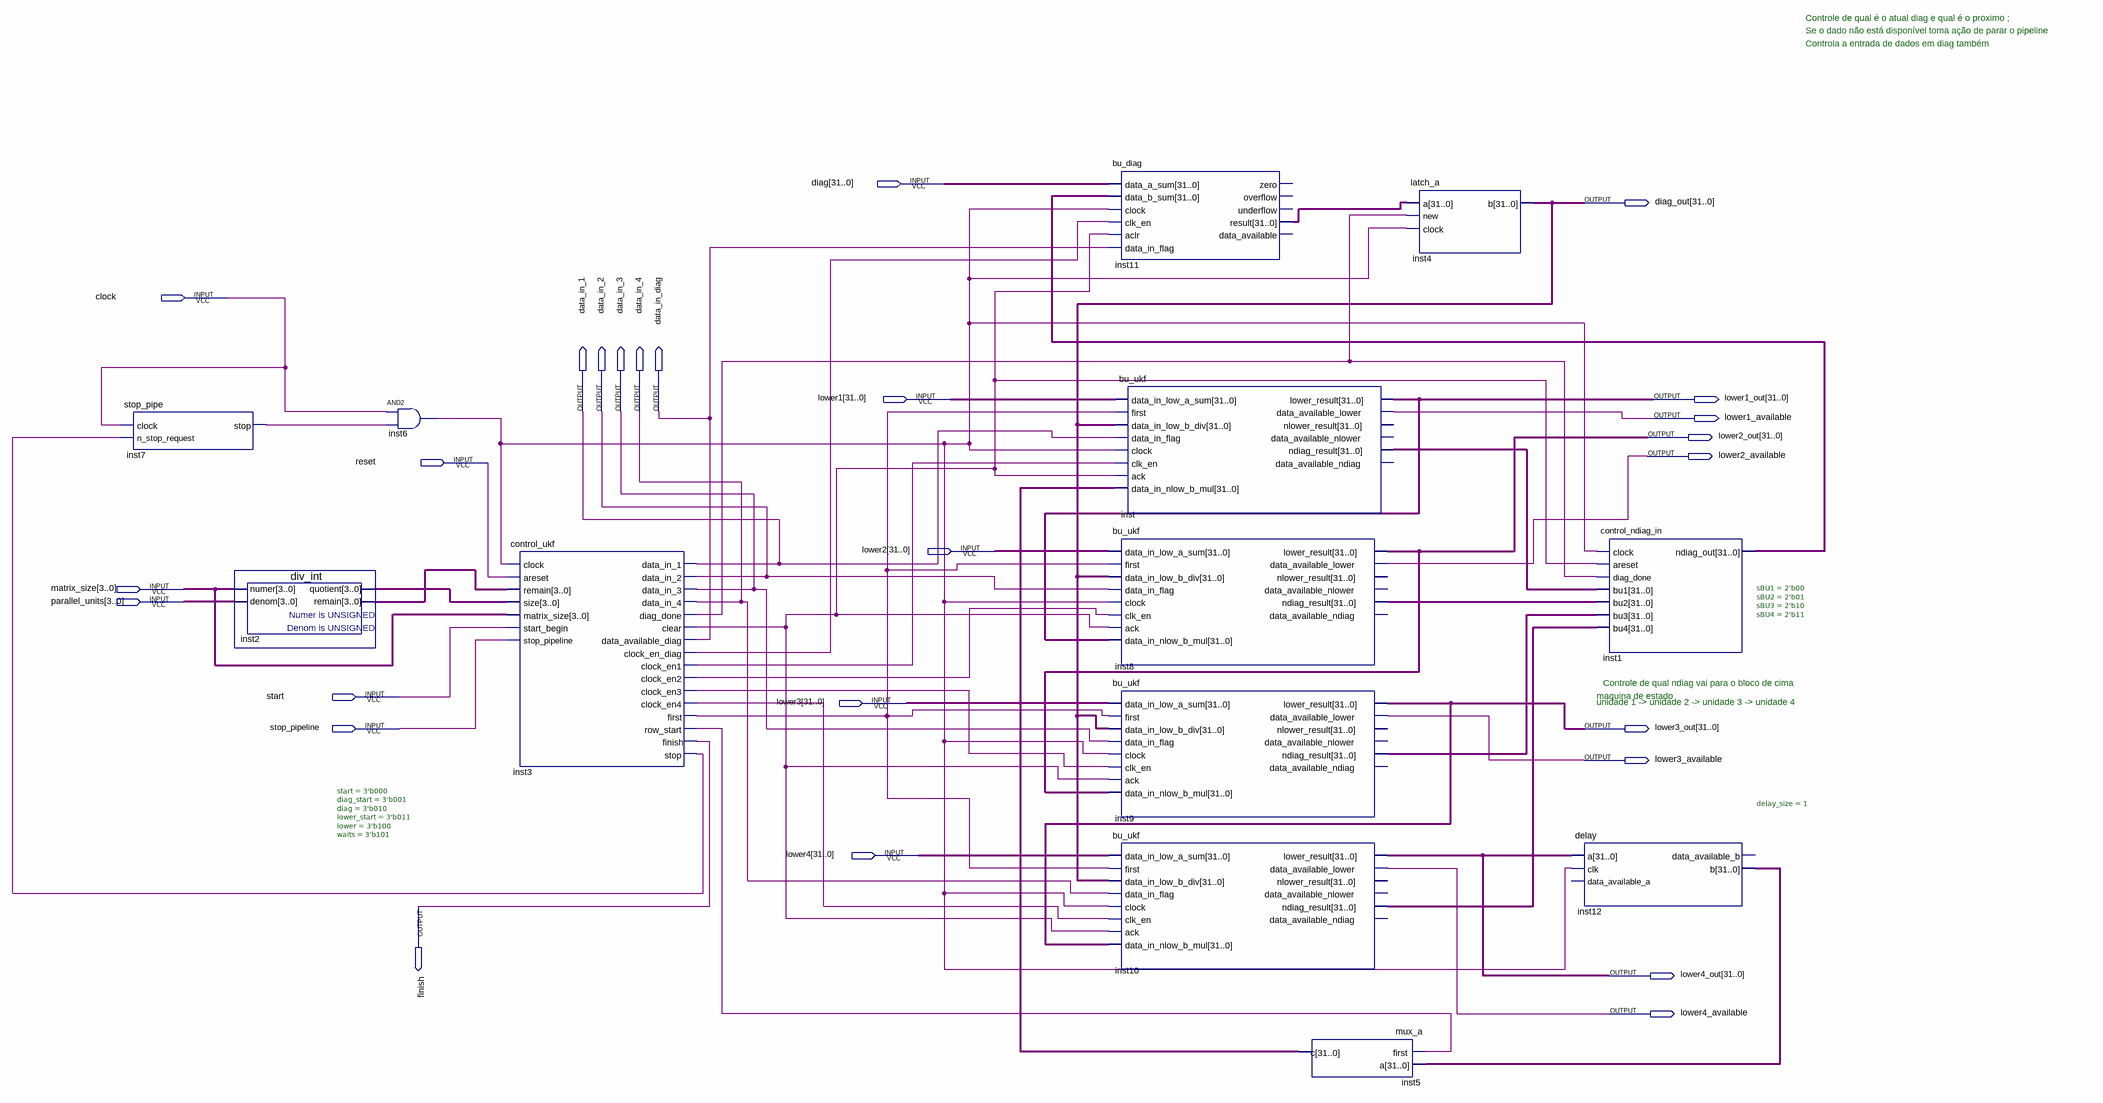
[diagram p0: schematic sheet]
// Quartus schematic ukf.bdf as structural Verilog: 13 symbols, 26 pins
module ukf (
  input  [31:0] diag,
  input  clock,
  input  [31:0] lower1,
  input  reset,
  input  [31:0] lower2,
  input  [3:0] matrix_size,
  input  [3:0] parallel_units,
  input  start,
  input  [31:0] lower3,
  input  stop_pipeline,
  input  [31:0] lower4,
  output [31:0] diag_out,
  output [31:0] lower1_out,
  output data_in_1,
  output data_in_2,
  output data_in_3,
  output data_in_4,
  output data_in_diag,
  output lower1_available,
  output [31:0] lower2_out,
  output lower2_available,
  output [31:0] lower3_out,
  output lower3_available,
  output finish,
  output [31:0] lower4_out,
  output lower4_available
);

  wire inst3_clear, inst3_clock_en1, inst3_clock_en2, inst3_clock_en3, inst3_clock_en4, inst3_clock_en_diag,
       inst3_diag_done, inst3_first, inst3_row_start, inst3_stop, inst6_out, inst7_stop;
  wire [3:0] inst2_quotient, inst2_remain;
  wire [31:0] inst1_ndiag_out, inst5_c, inst8_ndiag_result, inst9_ndiag_result, inst10_ndiag_result,
       inst11_result, inst12_b, inst_ndiag_result;

  stop_pipe inst7 (.clock(clock), .n_stop_request(inst3_stop), .stop(inst7_stop));
  div_int inst2 (.numer(matrix_size), .denom(parallel_units), .quotient(inst2_quotient), .remain(inst2_remain));
  and inst6 (inst6_out, clock, inst7_stop);
  control_ukf #(.start(3'b000), .diag_start(3'b001), .diag(3'b010), .lower_start(3'b011), .lower(3'b100), .waits(3'b101)) inst3 (
    .clock(inst6_out), .areset(reset), .remain(inst2_remain), .size(inst2_quotient),
    .matrix_size(matrix_size), .start_begin(start), .stop_pipeline(stop_pipeline), .data_in_1(data_in_1),
    .data_in_2(data_in_2), .data_in_3(data_in_3), .data_in_4(data_in_4), .diag_done(inst3_diag_done),
    .clear(inst3_clear), .data_available_diag(data_in_diag), .clock_en_diag(inst3_clock_en_diag),
    .clock_en1(inst3_clock_en1), .clock_en2(inst3_clock_en2), .clock_en3(inst3_clock_en3),
    .clock_en4(inst3_clock_en4), .first(inst3_first), .row_start(inst3_row_start), .finish(finish),
    .stop(inst3_stop));
  bu_diag inst11 (
    .data_a_sum(diag), .data_b_sum(inst1_ndiag_out), .clock(inst6_out), .clk_en(inst3_clock_en_diag),
    .aclr(inst3_clear), .data_in_flag(data_in_diag), .result(inst11_result));  // open: zero, overflow, underflow, data_available
  bu_ukf inst (
    .data_in_low_a_sum(lower1), .first(inst3_first), .data_in_low_b_div(diag_out), .data_in_flag(data_in_1),
    .clock(inst6_out), .clk_en(inst3_clock_en1), .ack(inst3_clear), .data_in_nlow_b_mul(inst5_c),
    .lower_result(lower1_out), .data_available_lower(lower1_available), .ndiag_result(inst_ndiag_result));  // open: nlower_result, data_available_nlower, data_available_ndiag
  bu_ukf inst8 (
    .data_in_low_a_sum(lower2), .first(inst3_first), .data_in_low_b_div(diag_out), .data_in_flag(data_in_2),
    .clock(inst6_out), .clk_en(inst3_clock_en2), .ack(inst3_clear), .data_in_nlow_b_mul(lower1_out),
    .lower_result(lower2_out), .data_available_lower(lower2_available), .ndiag_result(inst8_ndiag_result));  // open: nlower_result, data_available_nlower, data_available_ndiag
  bu_ukf inst9 (
    .data_in_low_a_sum(lower3), .first(inst3_first), .data_in_low_b_div(diag_out), .data_in_flag(data_in_3),
    .clock(inst6_out), .clk_en(inst3_clock_en3), .ack(inst3_clear), .data_in_nlow_b_mul(lower2_out),
    .lower_result(lower3_out), .data_available_lower(lower3_available), .ndiag_result(inst9_ndiag_result));  // open: nlower_result, data_available_nlower, data_available_ndiag
  bu_ukf inst10 (
    .data_in_low_a_sum(lower4), .first(inst3_first), .data_in_low_b_div(diag_out), .data_in_flag(data_in_4),
    .clock(inst6_out), .clk_en(inst3_clock_en4), .ack(inst3_clear), .data_in_nlow_b_mul(lower3_out),
    .lower_result(lower4_out), .data_available_lower(lower4_available), .ndiag_result(inst10_ndiag_result));  // open: nlower_result, data_available_nlower, data_available_ndiag
  mux_a inst5 (.first(inst3_row_start), .a(inst12_b), .c(inst5_c));
  latch_a inst4 (.a(inst11_result), .\new (inst3_diag_done), .clock(inst6_out), .b(diag_out));
  delay #(.delay_size(1)) inst12 (
    .a(lower4_out), .clk(inst6_out), .b(inst12_b));  // open: data_available_a, data_available_b
  control_ndiag_in #(.sBU1(2'b00), .sBU2(2'b01), .sBU3(2'b10), .sBU4(2'b11)) inst1 (
    .clock(inst6_out), .areset(inst3_clear), .diag_done(inst3_diag_done), .bu1(inst_ndiag_result),
    .bu2(inst8_ndiag_result), .bu3(inst9_ndiag_result), .bu4(inst10_ndiag_result), .ndiag_out(inst1_ndiag_out));

  // Notes on the sheet:
  //   Controle de qual é o atual diag e qual é o proximo ; 
  //   Se o dado não está disponível toma ação de parar o pipeline
  //   Controla a entrada de dados em diag também
  //   Controle de qual ndiag vai para o bloco de cima
  //   maquina de estado
  //   unidade 1 -> unidade 2 -> unidade 3 -> unidade 4
endmodule
